# EAGLE design sandbox_jack_2c (EAGLE 7.7.0)
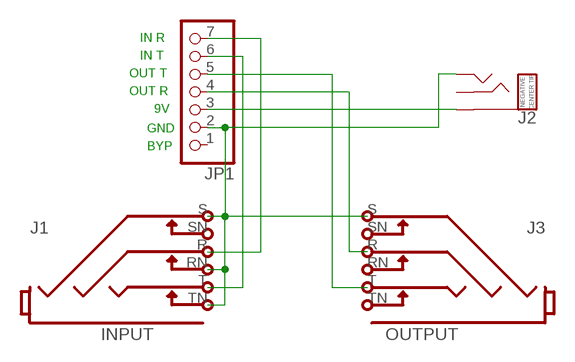
[diagram p0: schematic, sheet 1]

## Parts
J1  STEREOSW3NOMOUNT  [NEUTRIK-NRJ6HF-NOMOUNT]
J2  DC_TRS  [JACK_DC_PC-MOUNT_2.1MM_NO-KEEPOUT]
J3  STEREOSW3NOMOUNT  [NEUTRIK-NRJ6HF-NOMOUNT]
JP1  PINHD-1X7  [1X07]

## Nets
JACK_GND: J1.RN J1.S J1.TN J2.3(GND) J3.S JP1.2
N$1: J1.R JP1.7
N$34: J2.1(PWR) JP1.3
N$46: J1.T JP1.6
N$47: J3.T JP1.5
N$48: J3.R JP1.4
Unconnected: J1.SN J2.2(RNG) J3.RN J3.SN J3.TN JP1.1

## Notes on the sheet
- IN R
- IN T
- OUT T
- OUT R
- 9V
- GND
- BYP
- INPUT | OUTPUT

## Library data of the parts
J1 J3 = Audio Jacks 0.25 inch:STEREOSW3: 1/4" stereo jack, switched
J2 = eae-jacks:DC_TRS: Kobiconn Jack and TRS connections for DC power For center-tip negtaive connections (power from sleeve, ground from tip). Kobiconn 163-7620E: http://smallbear-electronics.mybigcommerce.com/plastic-2-1-mm-pc-mount/ Boss Style: http://smallbear-electronics.mybigcommerce.com/2-1-mm-all-plastic-round/
JP1 = pinhead:PINHD-1X7: PIN HEADER

## Board
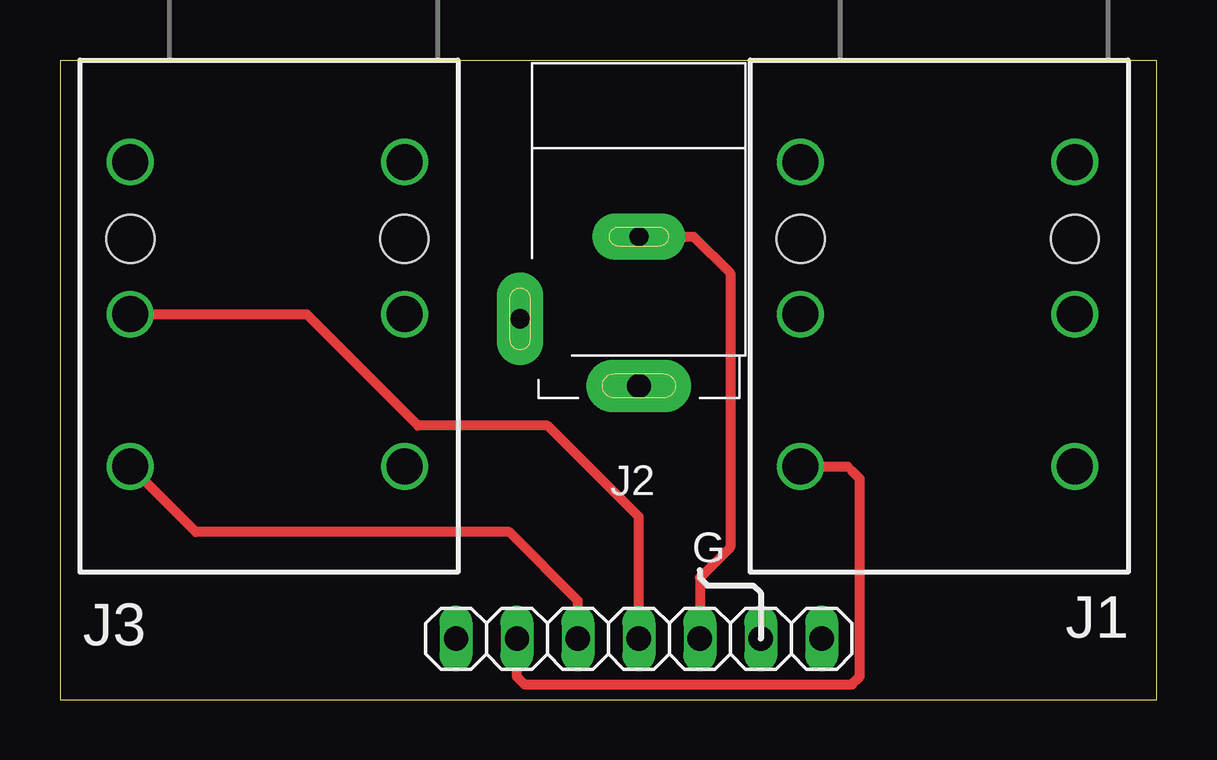
[diagram p1: board, top side]
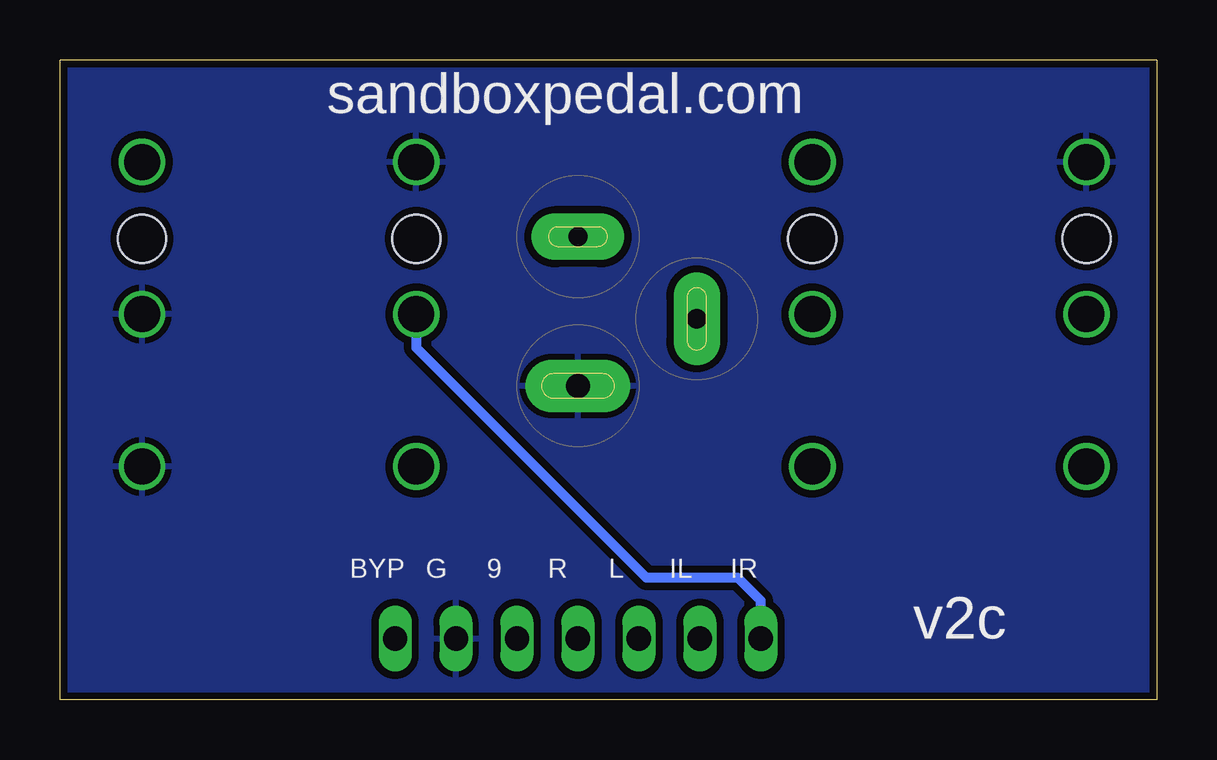
[diagram p2: board, bottom side, seen from below]

Size 45.72 x 26.67 mm. Coordinates in mm from the lower left corner, seen from the top.
Outline: 0,26.67 45.72,26.67 45.72,0 0,0 0,26.67
Copper layers (1*16): Top 0.035mm / dielectric 1.5mm / Bottom 0.035mm
Design rules "temp *": minimum track width 7mil, minimum drill 8mil, track to track 5mil, track to pad 5mil, pad to pad 5mil, via to via 5mil, smd to smd 0mil, copper to edge 10mil, drill to drill 8mil, minimum pad ring 7mil, minimum via ring 5mil, stop-mask expansion 2mil, vias tented up to drill 20mil, thermal gap 10mil

### Footprints (pad centres in the part's own frame; a part is rotated, then mirrored left to right if it is on the bottom)
NEUTRIK-NRJ6HF-NOMOUNT = drill 1.5: R 7.23,10.6; RN -4.2,10.6; S 7.23,4.25; SN -4.2,4.25; T 7.23,16.95; TN -4.2,16.95 | hole 2: 7.23,7.45; -4.2,7.45
JACK_DC_PC-MOUNT_2.1MM_NO-KEEPOUT = drill 0.8 pad 1.93 long: 1 0,3.429; 2 -4.953,0 | drill 1 pad 2.184 long: 3 0,-2.794
1X07 = drill 1.016 long: 1 -7.62,0; 2 -5.08,0; 3 -2.54,0; 4 0,0; 5 2.54,0; 6 5.08,0; 7 7.62,0

### Placement (x,y rotation side)
J1  38.1,26.67 180 top
J2  24.13,15.88 0 top
J3  10.16,26.67 180 top
JP1  24.13,2.54 180 top

### Tracks (layer width: path | path; a pad name or v marks a point on that pad's centre or on a via)
JACK_GND
  pour Bottom (isolate 0.305): 45.72,26.67 0,26.67 0,0 45.72,0
N$1
  Bottom 0.254: 30.87,14.68 30.8,14.61
  Bottom 0.406: 30.8,14.61 21.27,5.08 17.46,5.08 16.51,4.13 JP1.7 | J1.R 30.87,14.68
N$34
  Top 0.406: J2.1 26.42,19.3 27.94,17.78 27.94,6.35 26.67,5.08 JP1.3
N$46
  Top 0.254: 32.83,9.72 33.02,9.53
  Top 0.406: 33.02,9.53 33.34,9.21 33.34,0.95 33.02,0.64 19.37,0.64 19.05,0.95 JP1.6 | J1.T 32.83,9.72
N$47
  Top 0.406: J3.T 5.67,6.99 18.73,6.99 21.59,4.13 JP1.5
N$48
  Top 0.406: J3.R 10.28,16.07 14.92,11.43 20.32,11.43 24.13,7.62 JP1.4

### Text on the board
tPlace: G
bPlace: sandboxpedal.com | IR | IL | L | R | 9 | G | BYP | v2c